# Altium project HAB_Radio.PrjPcb
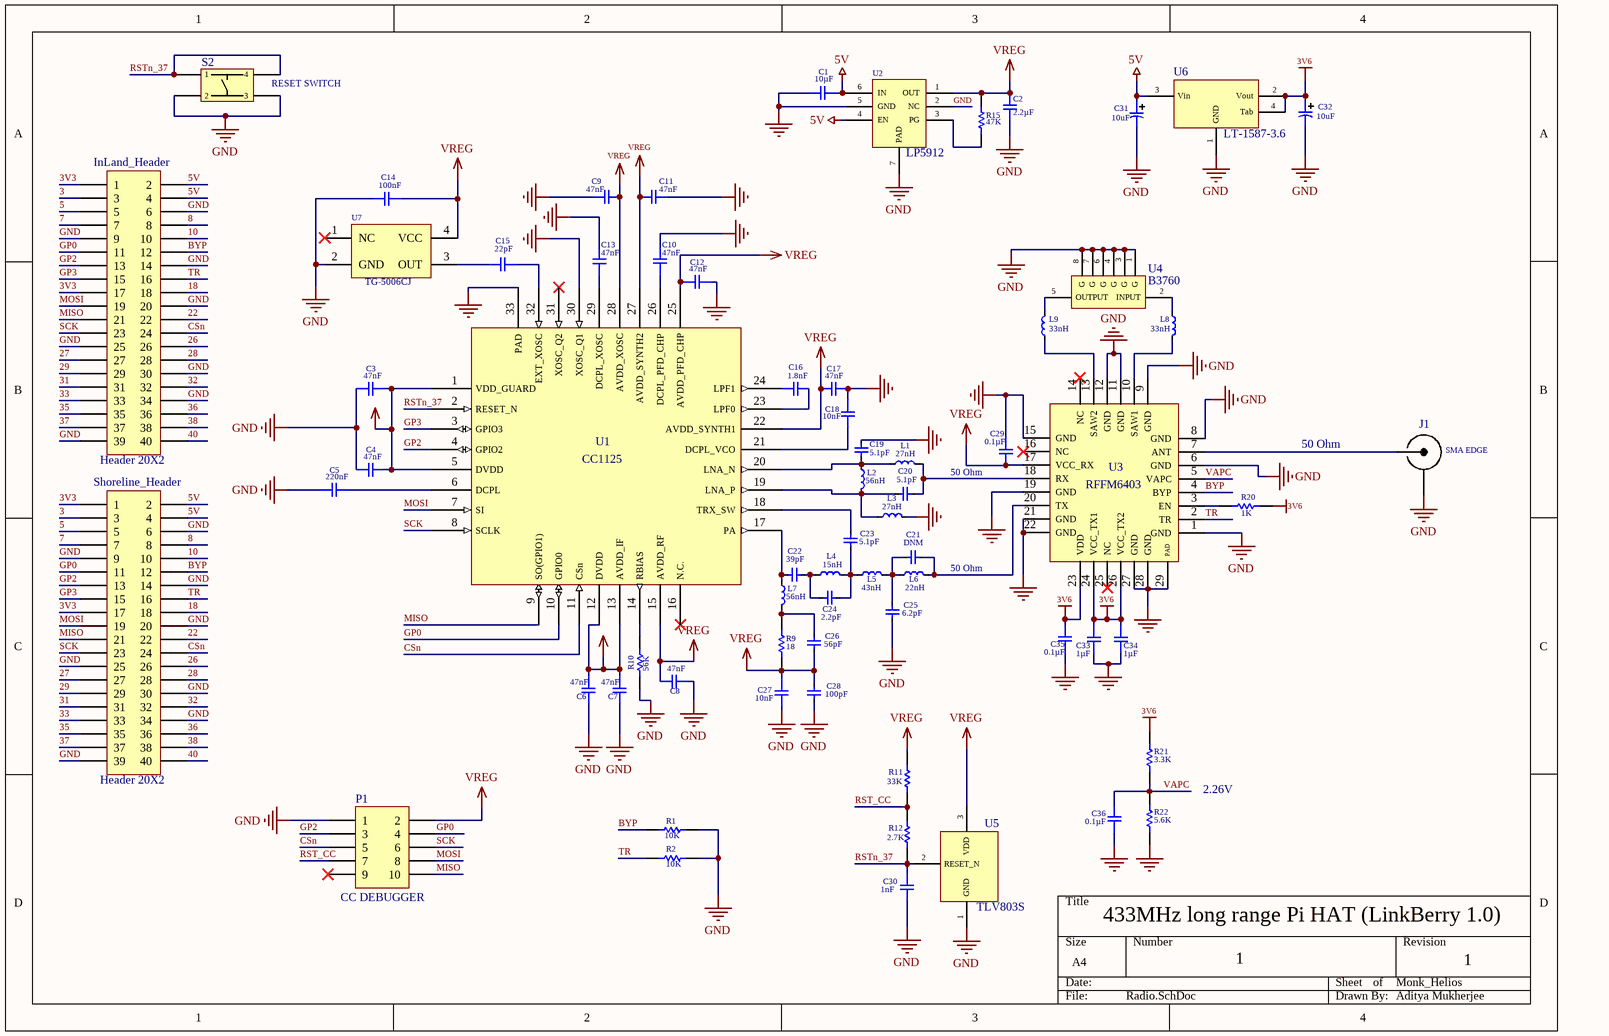
[diagram p0: Radio.SchDoc]
1 sheet, 67 parts. Net scope: global (net labels, ports and power ports of the same name join across sheets).
Board file: Radio.PcbDoc

## Sheet Radio.SchDoc
size A4

### Parts
C1  10µF  [SMD-0603C]
C2  2.2µF  [SMD-0603C]
C3  47nF  [SMD-0402C]
C4  47nF  [SMD-0402C]
C5  220nF  [SMD-0402C]
C6  47nF  [SMD-0402C]
C7  47nF  [SMD-0402C]
C8  47nF  [SMD-0402C]
C9  47nF  [SMD-0402C]
C10  47nF  [SMD-0402C]
C11  47nF  [SMD-0402C]
C12  47nF  [SMD-0402C]
C13  47nF  [SMD-0402C]
C14  100nF  [SMD-0402C]
C15  22pF  [SMD-0402C]
C16  1.8nF  [SMD-0402C]
C17  47nF  [SMD-0402C]
C18  10nF  [SMD-0402C]
C19  value 5.1pF  [0402]  (hidden comment: C0402)
C20  value 5.1pF  [0402]  (hidden comment: C0402)
C21  value DNM  [0402]  (hidden comment: C0402)
C22  value 39pF  [0402]  (hidden comment: C0402)
C23  value 5.1pF  [0402]  (hidden comment: C0402)
C24  value 2.2pF  [0402]  (hidden comment: C0402)
C25  value 6.2pF  [0402]  (hidden comment: C0402)
C26  value 56pF  [0402]  (hidden comment: C0402)
C27  10nF  [SMD-0402C]
C28  value 100pF  [0402]  (hidden comment: C0402)
C29  0.1µF  [SMD-0603C]
C30  1nF  [SMD-0402C]
C31  Component_1  [PCBComponent_1]  (value not drawn)
C32  Component_1  [PCBComponent_1]  (value not drawn)
C33  1µF  [SMD-0603C]
C34  1µF  [SMD-0603C]
C35  0.1µF  [SMD-0603C]
C36  0.1µF  [SMD-0603C]
InLand_Header  Header 20X2  [HDR2X20]
J1  SMA EDGE  [PCBComponent_1]
L1  Component_1  [LQW15AN80]  (value not drawn)
L2  Component_1  [LQW15AW80]  (value not drawn)
L3  Component_1  [LQW15AN80]  (value not drawn)
L4  Component_1  [LQW15AN80]  (value not drawn)
L5  Component_1  [LQW15AN80]  (value not drawn)
L6  Component_1  [LQW15AN80]  (value not drawn)
L7  Component_1  [LQW15AW80]  (value not drawn)
L8  Component_1  [LQW15AN80]  (value not drawn)
L9  Component_1  [LQW15AN80]  (value not drawn)
P1  CC DEBUGGER  [HDR2X5]
R1  10K  [2-0402]
R2  10K  [2-0402]
R9  value 18  [2-0402]  (hidden comment: ERJ2GE)
R10  value 56K  [2-0402]  (hidden comment: ERJ2GE)
R11  10K  [2-0402]  (value not drawn)
R12  10K  [2-0402]  (value not drawn)
R15  value 47K  [ERA-0603]  (hidden comment: ERA3Y)
R20  value 1K  [2-0402]  (hidden comment: ERJ2GE)
R21  value 3.3K  [2-0402]  (hidden comment: ERJ2GE)
R22  value 5.6K  [2-0402]  (hidden comment: ERJ2GE)
S2  RESET SWITCH  [PCBComponent_1]
Shoreline_Header  Header 20X2  [HDR2X20]
U1  CC1125  [CC1125 QFN]
U2  LP5912  [LP5912_WSON]
U3  RFFM6403  [PCBComponent_1]
U4  B3760  [PCBComponent_1]
U5  TLV803S  [SOT95P237X110-3N]
U6  LT1587-3.6  [LT1587]  (value not drawn)
U7  TG-5006CJ  [TG-5006CJ]

### Nets
3V6: C32.1 C33.1 C34.1 C35.2 R20.1 R21.2 U3.23(VDD) U3.24(VCC_TX1) U3.26(VCC_TX2) U6.2(Vout) U6.4(Tab)
5V: C1.1 C31.1 InLand_Header.2 InLand_Header.4 Shoreline_Header.2 Shoreline_Header.4 U2.4(EN) U2.6(IN) U6.3(Vin)
GND: C1.2 C2.2 C3.1 C4.1 C5.1 C6.2 C7.2 C8.2 C9.1 C10.2 C11.2 C12.1 C13.2 C14.2 C17.1 C18.1 C19.2 C25.1 C27.2 C28.1 C29.1 C30.2 C31.2 C32.2 C33.2 C34.2 C35.1 C36.1 InLand_Header.6 InLand_Header.9 InLand_Header.14 InLand_Header.20 InLand_Header.25 InLand_Header.30 InLand_Header.34 InLand_Header.39 J1.2 L3.1 P1.1 R1.1 R2.1 R10.1 R22.1 S2.2 S2.3 Shoreline_Header.6 Shoreline_Header.9 Shoreline_Header.14 Shoreline_Header.20 Shoreline_Header.25 Shoreline_Header.30 Shoreline_Header.34 Shoreline_Header.39 U1.30(XOSC_Q1) U1.33(PAD) U2.2(NC) U2.5(GND) U2.7(PAD) U3.1(GND) U3.6(GND) U3.8(GND) U3.9(GND) U3.11(GND) U3.12(GND) U3.15(GND) U3.19(GND) U3.21(GND) U3.22(GND) U3.27(GND) U3.28(GND) U3.29(PAD) U4.1(G) U4.3(G) U4.4(G) U4.6(G) U4.7(G) U4.8(G) U5.1(GND) U6.1(GND) U7.2(GND)
VREG: C2.1 C3.2 C4.2 C6.1 C7.1 C8.1 C9.2 C11.1 C12.2 C14.1 C17.2 C26.1 C27.1 C28.2 C29.2 P1.2 R9.1 R11.2 R15.2 U1.1(VDD_GUARD) U1.5(DVDD) U1.12(DVDD) U1.13(AVDD_IF) U1.15(AVDD_RF) U1.22(AVDD_SYNTH1) U1.25(AVDD_PFD_CHP) U1.27(AVDD_SYNTH2) U1.28(AVDD_XOSC) U2.1(OUT) U3.17(VCC_RX) U5.3(VDD) U7.4(VCC)
3: InLand_Header.3 Shoreline_Header.3
3V3: InLand_Header.1 InLand_Header.17 Shoreline_Header.1 Shoreline_Header.17
5: InLand_Header.5 Shoreline_Header.5
7: InLand_Header.7 Shoreline_Header.7
8: InLand_Header.8 Shoreline_Header.8
10: InLand_Header.10 Shoreline_Header.10
18: InLand_Header.18 Shoreline_Header.18
22: InLand_Header.22 Shoreline_Header.22
26: InLand_Header.26 Shoreline_Header.26
27: InLand_Header.27 Shoreline_Header.27
28: InLand_Header.28 Shoreline_Header.28
29: InLand_Header.29 Shoreline_Header.29
31: InLand_Header.31 Shoreline_Header.31
32: InLand_Header.32 Shoreline_Header.32
33: InLand_Header.33 Shoreline_Header.33
35: InLand_Header.35 Shoreline_Header.35
36: InLand_Header.36 Shoreline_Header.36
37: InLand_Header.37 Shoreline_Header.37
38: InLand_Header.38 Shoreline_Header.38
40: InLand_Header.40 Shoreline_Header.40
BYP: InLand_Header.12 R1.2 Shoreline_Header.12 U3.4(BYP)
CSn: InLand_Header.24 P1.5 Shoreline_Header.24 U1.11(CSn)
GP0: InLand_Header.11 P1.4 Shoreline_Header.11 U1.10(GPIO0)
GP2: InLand_Header.13 P1.3 Shoreline_Header.13 U1.4(GPIO2)
GP3: InLand_Header.15 Shoreline_Header.15 U1.3(GPIO3)
MISO: InLand_Header.21 P1.10 Shoreline_Header.21 U1.9(SO(GPIO1))
MOSI: InLand_Header.19 P1.8 Shoreline_Header.19 U1.7(SI)
RST_CC: P1.7 R11.1 R12.2
RSTn_37: C30.1 R12.1 S2.1 S2.4 U1.2(RESET_N) U5.2(RESET_N)
SCK: InLand_Header.23 P1.6 Shoreline_Header.23 U1.8(SCLK)
TR: InLand_Header.16 R2.2 Shoreline_Header.16 U3.2(TR)
VAPC: C36.2 R21.1 R22.2 U3.5(VAPC)
NetC5_2: C5.2 U1.6(DCPL)
NetC10_1: C10.1 U1.26(DCPL_PFD_CHP)
NetC13_1: C13.1 U1.29(DCPL_XOSC)
NetC15_1: C15.1 U1.32(EXT_XOSC)
NetC15_2: C15.2 U7.3(OUT)
NetC16_1: C16.1 U1.24(LPF1)
NetC16_2: C16.2 U1.23(LPF0)
NetC18_2: C18.2 U1.21(DCPL_VCO)
NetC19_1: C19.1 L1.2 L2.2 U1.20(LNA_N)
NetC20_1: C20.1 L2.1 L3.2 U1.19(LNA_P)
NetC20_2: C20.2 L1.1 U3.18(RX)
NetC21_1: C21.1 C25.2 L5.1 L6.2
NetC21_2: C21.2 L6.1 U3.20(TX)
NetC22_1: C22.1 L7.2 U1.17(PA)
NetC22_2: C22.2 C24.1 L4.2
NetC23_1: C23.1 C24.2 L4.1 L5.2
NetC23_2: C23.2 U1.18(TRX_SW)
NetC26_2: C26.2 L7.1 R9.2
NetJ1_1: J1.1 U3.7(ANT)
NetL8_1: L8.1 U3.10(SAW1)
NetL8_2: L8.2 U4.2(INPUT)
NetL9_1: L9.1 U4.5(OUTPUT)
NetL9_2: L9.2 U3.13(SAW2)
NetR10_2: R10.2 U1.14(RBIAS)
NetR15_1: R15.1 U2.3(PG)
NetR20_2: R20.2 U3.3(EN)

Not connected (* = marked no-connect by the designer): P1 9*; U1 16(N.C.)* 31(XOSC_Q2)*; U3 14(NC)* 16(NC)* 25(NC)*; U7 1(NC)*

### Notes on the sheet
- 50 Ohm
- 2.26V
- 433MHz long range Pi HAT (LinkBerry 1.0)
- 1
- Monk_Helios
- Aditya Mukherjee
- (in symbol Component_1) 56nH; 27nH; 22nH; 43nH; 15nH; LT-1587-3.6; 10uF; 33nH
- (in symbol ERJ2RE) 33K; 2.7K

### Library data of the parts
C1 C2 C29 C35 C36 = GCJ188R71C104KA01D: CAP CER 0.1UF 16V X7R 0603; Manufacturer: Murata Electronics North America; Factory Stock: 0; Unit Price (USD): 0.21; Minimum Quantity: 1; Tolerance: ±10%; Datasheets: http://www.murata.com/~/media/webrenewal/support/library/catalog/products/capacitor/mlcc/c03e.ashx; Image: //media.digikey.com/Renders/Murata%20Renders/0603%28LQG18%29.jpg; Digi-Key Part Number: 490-5796-1-ND; Part Number: GCJ188R71C104KA01D; Quantity Available: 22473; @ qty: 0; Packaging: Cut Tape (CT); Series: GCJ; Part Status: Active; Voltage: 16V; Temperature Coefficient: X7R; Operating Temperature: -55°C ~ 125°C; Features: Soft Termination; Ratings: AEC-Q200; Applications: Automotive, Boardflex Sensitive; Mounting Type: Surface Mount, MLCC; Package / Case: 0603 (1608 Metric); Size / Dimension: 0.063" L x 0.031" W (1.60mm x 0.80mm); Height - Seated (Max): -; Thickness (Max): 0.035" (0.90mm); Lead Spacing: -; Lead Style: -
  C1: Value: 10µF
  C2: Value: 2.2µF
  C29 C35 C36: Value: 0.1µF
C3-C14 C17 C18 C27 C30 = GCM155C71A105KE38D: CAP CER 1UF 10V X7S 0402; Manufacturer: Murata Electronics North America; Factory Stock: 0; Unit Price (USD): 0.12; Minimum Quantity: 1; Tolerance: ±10%; Datasheets: http://www.murata.com/~/media/webrenewal/support/library/catalog/products/capacitor/mlcc/c03e.ashx; Image: //media.digikey.com/Renders/Murata%20Renders/ZRB-SERIES-0402.jpg; Digi-Key Part Number: 490-13409-1-ND; Part Number: GCM155C71A105KE38D; Quantity Available: 7240; @ qty: 0; Packaging: Cut Tape (CT); Series: GCM; Part Status: Active; Voltage: 10V; Temperature Coefficient: X7S; Operating Temperature: -55°C ~ 125°C; Features: -; Ratings: AEC-Q200; Applications: Automotive; Mounting Type: Surface Mount, MLCC; Package / Case: 0402 (1005 Metric); Size / Dimension: 0.039" L x 0.020" W (1.00mm x 0.50mm); Height - Seated (Max): -; Thickness (Max): 0.022" (0.55mm); Lead Spacing: -; Lead Style: -
  C3 C4 C6-C13 C17: Value: 47nF
  C5: Value: 220nF
  C14: Value: 100nF
  C18 C27: Value: 10nF
  C30: Value: 1nF
C15 = GCM155C71A105KE38D: CAP CER 1UF 50V NP0 0402; Manufacturer: Murata Electronics North America; Factory Stock: 0; Unit Price (USD): 0.12; Minimum Quantity: 1; Tolerance: ±10%; Voltage: 10V; Temperature Coefficient: X7S; Datasheets: http://www.murata.com/~/media/webrenewal/support/library/catalog/products/capacitor/mlcc/c03e.ashx; Image: //media.digikey.com/Renders/Murata%20Renders/ZRB-SERIES-0402.jpg; Digi-Key Part Number: 490-13409-1-ND; Part Number: GCM155C71A105KE38D; Quantity Available: 7240; @ qty: 0; Packaging: Cut Tape (CT); Series: GCM; Part Status: Active; Value: 22pF; Operating Temperature: -55°C ~ 125°C; Features: -; Ratings: AEC-Q200; Applications: Automotive; Mounting Type: Surface Mount, MLCC; Package / Case: 0402 (1005 Metric); Size / Dimension: 0.039" L x 0.020" W (1.00mm x 0.50mm); Height - Seated (Max): -; Thickness (Max): 0.022" (0.55mm); Lead Spacing: -; Lead Style: -
C16 = GCM155C71A105KE38D: CAP CER 1.8nF 10V X7S 0402; Manufacturer: Murata Electronics North America; Factory Stock: 0; Unit Price (USD): 0.12; Minimum Quantity: 1; Tolerance: ±10%; Datasheets: http://www.murata.com/~/media/webrenewal/support/library/catalog/products/capacitor/mlcc/c03e.ashx; Image: //media.digikey.com/Renders/Murata%20Renders/ZRB-SERIES-0402.jpg; Digi-Key Part Number: 490-13409-1-ND; Part Number: GCM155C71A105KE38D; Quantity Available: 7240; @ qty: 0; Packaging: Cut Tape (CT); Series: GCM; Part Status: Active; Value: 1.8nF; Voltage: 10V; Temperature Coefficient: X7S; Operating Temperature: -55°C ~ 125°C; Features: -; Ratings: AEC-Q200; Applications: Automotive; Mounting Type: Surface Mount, MLCC; Package / Case: 0402 (1005 Metric); Size / Dimension: 0.039" L x 0.020" W (1.00mm x 0.50mm); Height - Seated (Max): -; Thickness (Max): 0.022" (0.55mm); Lead Spacing: -; Lead Style: -
C19-C26 C28 = C0402: Ceramic Chip Capacitor - Standard; Note: Footprint corresponds to dimensions for bulk cassette packaging. This case size has tightened tolerances.; Published: 17-Jul-2002; LatestRevisionDate: 19-Mar-2004; LatestRevisionNote: Silkscreen size reduced.; DatasheetDocument: Mar-2001; PackageDocument: Mar-2001; PackageReference: 0402; Publisher: Altium Limited; Code_JEITA: 0402; Code_IPC: 1005 [0402]; ComponentLink1Description: Manufacturer Link; ComponentLink1URL: http://www.kemet.com/; ComponentLink2Description: Datasheet; ComponentLink2URL: http://www.kemet.com/kemet/web/homepage/kechome.nsf/vapubfilesname/F3102TA.pdf/$file/F3102TA.pdf
C33 C34 = GCJ188R71C104KA01D: CAP CER 1UF 16V X7R 0603; Manufacturer: Murata Electronics North America; Factory Stock: 0; Unit Price (USD): 0.21; Minimum Quantity: 1; Tolerance: ±10%; Datasheets: http://www.murata.com/~/media/webrenewal/support/library/catalog/products/capacitor/mlcc/c03e.ashx; Image: //media.digikey.com/Renders/Murata%20Renders/0603%28LQG18%29.jpg; Digi-Key Part Number: 490-5796-1-ND; Part Number: GCJ188R71C104KA01D; Quantity Available: 22473; @ qty: 0; Packaging: Cut Tape (CT); Series: GCJ; Part Status: Active; Value: 1µF; Voltage: 16V; Temperature Coefficient: X7R; Operating Temperature: -55°C ~ 125°C; Features: Soft Termination; Ratings: AEC-Q200; Applications: Automotive, Boardflex Sensitive; Mounting Type: Surface Mount, MLCC; Package / Case: 0603 (1608 Metric); Size / Dimension: 0.063" L x 0.031" W (1.60mm x 0.80mm); Height - Seated (Max): -; Thickness (Max): 0.035" (0.90mm); Lead Spacing: -; Lead Style: -
InLand_Header Shoreline_Header = Header 20X2: Header, 20-Pin, Dual row; LatestRevisionDate: 17-Jul-2002; LatestRevisionNote: Re-released for DXP Platform.; Publisher: Altium Limited
J1 S2 U4-U6 = Component_1
P1 = Header 5X2: Header, 5-Pin, Dual row; LatestRevisionDate: 17-Jul-2002; LatestRevisionNote: Re-released for DXP Platform.; Publisher: Altium Limited
R1 R2 R11 R12 = ERJ2RE: Precision Thick Film Chip Resistor, 10 Ohm to 1M Ohm Range, 1% and 0.5% Tolerance, 0402 Size, 0.063 W; Published: 17-Dec-2003; LatestRevisionDate: 19-Mar-2004; LatestRevisionNote: Silkscreen size reduced.; PackageDocument: Mar-2003; PackageReference: 2-0402; Publisher: Altium Limited; Code_IPC: 1005 [0402]; ComponentLink1Description: Manufacturer Link; ComponentLink1URL: http://www.panasonic.com/industrial/components/resistive_products.htm; ComponentLink2Description: Datasheet; ComponentLink2URL: http://www.panasonic.com/industrial/components/pdf/AOA0000CE2.pdf
R9 R10 R20-R22 = ERJ2GE: Thick Film Chip Resistor, 1 Ohm to 2.2M Ohm Range, 5% Tolerance, 0402 Size, 0.063 W; Note: If flow soldering, adjust pad width of PCB Footprint to 0.7 - 0.8 times the width of the resistor.; Published: 17-Dec-2003; LatestRevisionDate: 19-Mar-2004; LatestRevisionNote: Silkscreen size reduced.; PackageDocument: Mar-2003; PackageReference: 2-0402; Publisher: Altium Limited; Code_IPC: 1005 [0402]; ComponentLink1Description: Manufacturer Link; ComponentLink1URL: http://www.panasonic.com/industrial/components/resistive_products.htm; ComponentLink2Description: Datasheet; ComponentLink2URL: http://www.panasonic.com/industrial/components/pdf/AOA0000CE1.pdf
R15 = ERA3Y: Rectangular Thick Film Chip Resistor, 10 Ohm to 330k Ohm Range, 0.1% and 0.5% Tolerance, 0603 Size, 0.063 W; Note: If flow soldering, adjust pad width of PCB Footprint to 0.7 - 0.8 times the width of the resistor.; Published: 17-Dec-2003; LatestRevisionDate: 19-Mar-2004; LatestRevisionNote: Silkscreen size reduced.; PackageDocument: Mar-2003; PackageReference: ERA-0603; Publisher: Altium Limited; Code_IPC: 1608 [0603]; ComponentLink1Description: Manufacturer Link; ComponentLink1URL: http://www.panasonic.com/industrial/components/resistive_products.htm; ComponentLink2Description: Datasheet; ComponentLink2URL: http://www.panasonic.com/industrial/components/pdf/AOA0000CE8.pdf